# EAGLE design AGC-Amplifier-LM13600-Mono (EAGLE 7.2.0)
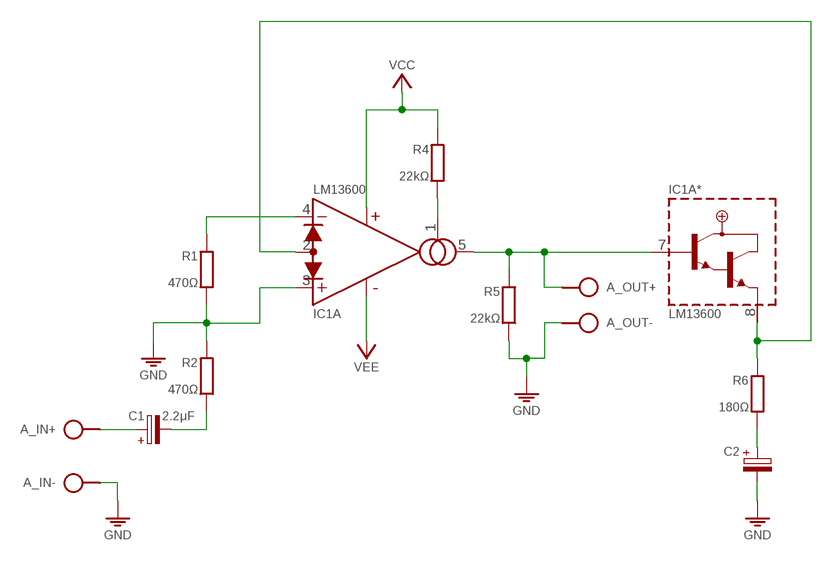
[diagram p0: schematic, sheet 1]

## Parts
A_IN  SPAD+-+-  [SPAD+-]
A_OUT  SPAD+-+-  [SPAD+-]
C1  2.2μF  CPOL-HE2,5-4/V  [E2.5-4/V]
C2  CPOLE2,5-4/V  [E2.5-4/V]
IC1  LM13600  [DIL16]
PWR  VCC_GND_VEEPWR-+GND-  [SPAD-PWR-+GND-]
R1  470Ω  R0202/7  [0202/7]
R2  470Ω  R0202/7-V  [0202/7-V]
R4  22kΩ  R0202/7  [0202/7]
R5  22kΩ  R0202/7-V  [0202/7-V]
R6  180Ω  R0202/7  [0202/7]

## Nets
GND: A_IN.1 A_OUT.1 C2.- IC1.3(A:+IN) PWR.GND R1.2 R2.1 R5.2
N$1: IC1.1(A:AMP/BIAS) R4.2
N$2: C1.- R2.2
N$3: C2.+ R6.2
N$4: IC1.4(A:-IN) R1.1
N$5: IC1.2(A:DIODE/BIAS) IC1.8(A*:BUFF/OUT) R6.1
N$6: A_IN.2 C1.+
N$7: A_OUT.2 IC1.5(A:OUT) IC1.7(A*:BUFF/IN) R5.1
VCC: IC1.11(5:V+) PWR.VCC R4.1
VEE: IC1.6(5:V-) PWR.VEE
Unconnected: IC1.9(B*:BUFF/IN) IC1.10(B*:BUFF/OUT) IC1.12(B:OUT) IC1.13(B:-IN) IC1.14(B:+IN) IC1.15(B:DIODE/BIAS) IC1.16(B:AMP/BIAS)

## Library data of the parts
A_IN A_OUT = pad:SPAD+-
C1 = c:CPOL-H
C2 = c:CPOL: POLARIZED CAPACITOR, European symbol
IC1 = ic:LM13600
PWR = pad:VCC_GND_VEE
R1 R2 R4-R6 = r:R: RESISTOR, European symbol

## Net classes
0 default: width 0.61 mm

## Board
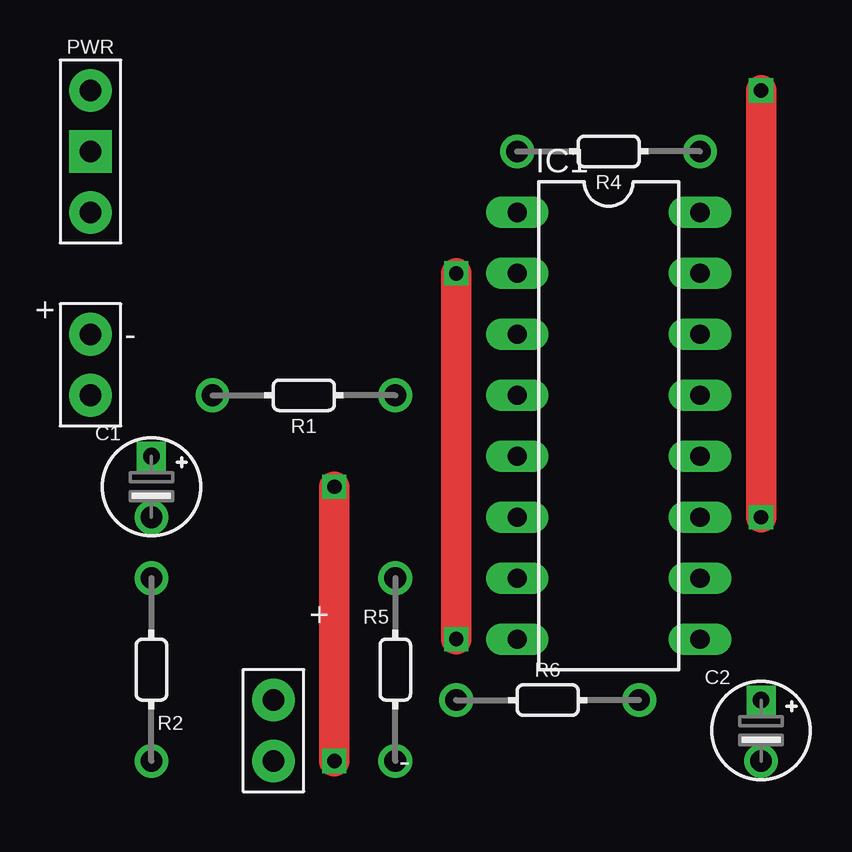
[diagram p1: board, top side]
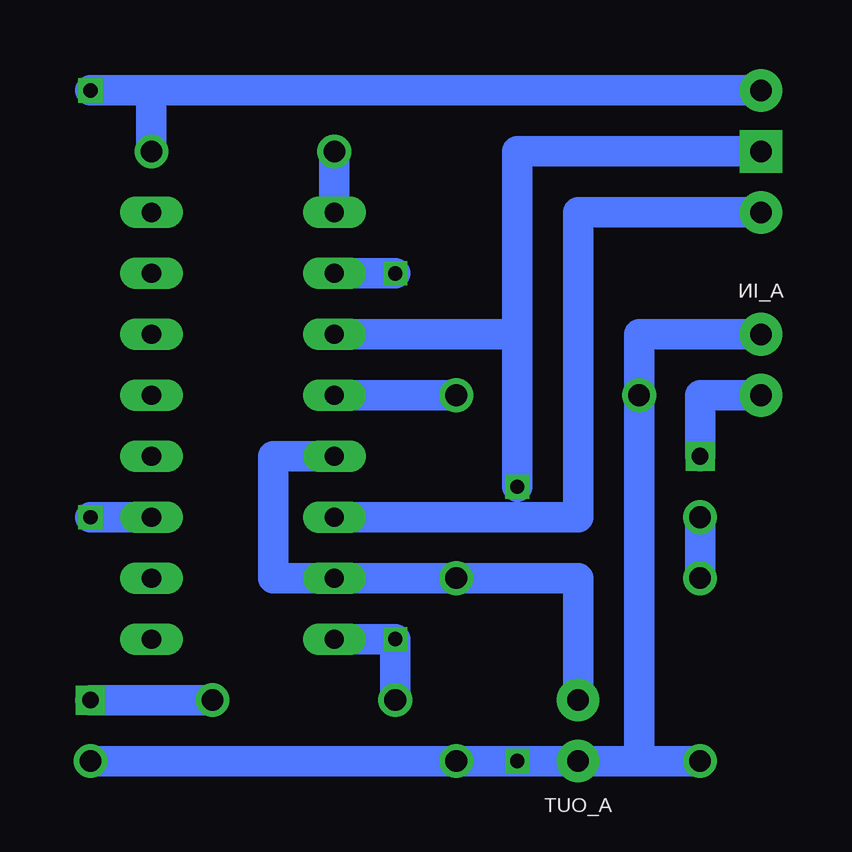
[diagram p2: board, bottom side, seen from below]

No outline drawn. Coordinates in mm, seen from the top.
Copper layers (1*16): Top 0.035mm / dielectric 1.5mm / Bottom 0.035mm
Design rules "default": minimum track width 10mil, minimum drill 24mil, track to track 8mil, track to pad 8mil, pad to pad 8mil, via to via 8mil, smd to smd 8mil, copper to edge 40mil, drill to drill 8mil, minimum pad ring 10mil, minimum via ring 8mil, stop-mask expansion 4mil, vias tented up to drill 0mil, thermal gap 10mil

### Footprints (pad centres in the part's own frame; a part is rotated, then mirrored left to right if it is on the bottom)
SPAD+- = drill 0.9 pad 1.778: 1 0,-1.27; 2 0,1.27
E2.5-4/V = drill 0.7 square: + 0,1.27 | drill 0.9: - 0,-1.27
DIL16 = drill 0.8 long: 1 -3.81,8.89; 2 -3.81,6.35; 3 -3.81,3.81; 4 -3.81,1.27; 5 -3.81,-1.27; 6 -3.81,-3.81; 7 -3.81,-6.35; 8 -3.81,-8.89; 9 3.81,-8.89; 10 3.81,-6.35; 11 3.81,-3.81; 12 3.81,-1.27; 13 3.81,1.27; 14 3.81,3.81; 15 3.81,6.35; 16 3.81,8.89
SPAD-PWR-+GND- = drill 0.9 pad 1.778 square: GND 0,0 | drill 0.9 pad 1.778: VCC 0,2.54; VEE 0,-2.54
0202/7 = drill 0.9: 1 -3.81,0; 2 3.81,0
0202/7-V = drill 0.9: 1 0,3.81; 2 0,-3.81

### Placement (x,y rotation side)
A_IN  0,16.51 180 top
A_OUT  7.62,1.27 0 top
C1  2.54,11.43 0 top
C2  27.94,1.27 0 top
IC1  21.59,13.97 0 top
PWR  0,25.4 0 top
R1  8.89,15.24 180 top
R2  2.54,3.81 180 top
R4  21.59,25.4 180 top
R5  12.7,3.81 0 top
R6  19.05,2.54 0 top

### Tracks (layer width: path | path; a pad name or v marks a point on that pad's centre or on a via)
GND  (via drill 0.6)
  Top 1.27: v10.16,11.43 v10.16,0
  Bottom 1.27: A_IN.1 5.08,17.78 R1.2 5.08,0 R2.1 A_OUT.1 v10.16,0 R5.2 C2.- | PWR.GND 10.16,25.4 10.16,17.78 | 10.16,17.78 IC1.3 | 10.16,17.78 v10.16,11.43
N$1
  Bottom 1.27: R4.2 IC1.1
N$2
  Bottom 1.27: C1.- R2.2
N$3
  Bottom 1.27: R6.2 C2.+
N$4
  Bottom 1.27: IC1.4 R1.1
N$5  (via drill 0.6)
  Top 1.27: v15.24,5.08 v15.24,20.32
  Bottom 1.27: R6.1 v15.24,5.08 IC1.8 | v15.24,20.32 IC1.2
N$6
  Bottom 1.27: A_IN.2 2.54,15.24 C1.+
N$7
  Bottom 1.27: A_OUT.2 7.62,7.62 R5.1 IC1.7 20.32,7.62 20.32,12.7 IC1.5
VCC  (via drill 0.6)
  Top 1.27: v27.94,27.94 v27.94,10.16
  Bottom 1.27: v27.94,10.16 IC1.11 | 25.4,27.94 v27.94,27.94 | 25.4,27.94 PWR.VCC | R4.1 25.4,27.94
VEE
  Bottom 1.27: PWR.VEE 7.62,22.86 7.62,10.16 IC1.6

### Text on the board
Dimension: 12 | 11 | 10 | 9 | 8 | 7 | 6 | 5 | 4 | 3 | 2 | 1 | 1 | 2 | 3 | 4 | 5 | 6 | 7 | 8 | 9 | 10 | 11 | 12